# EAGLE design TSOC_WaterSensor (EAGLE 6.6.0)
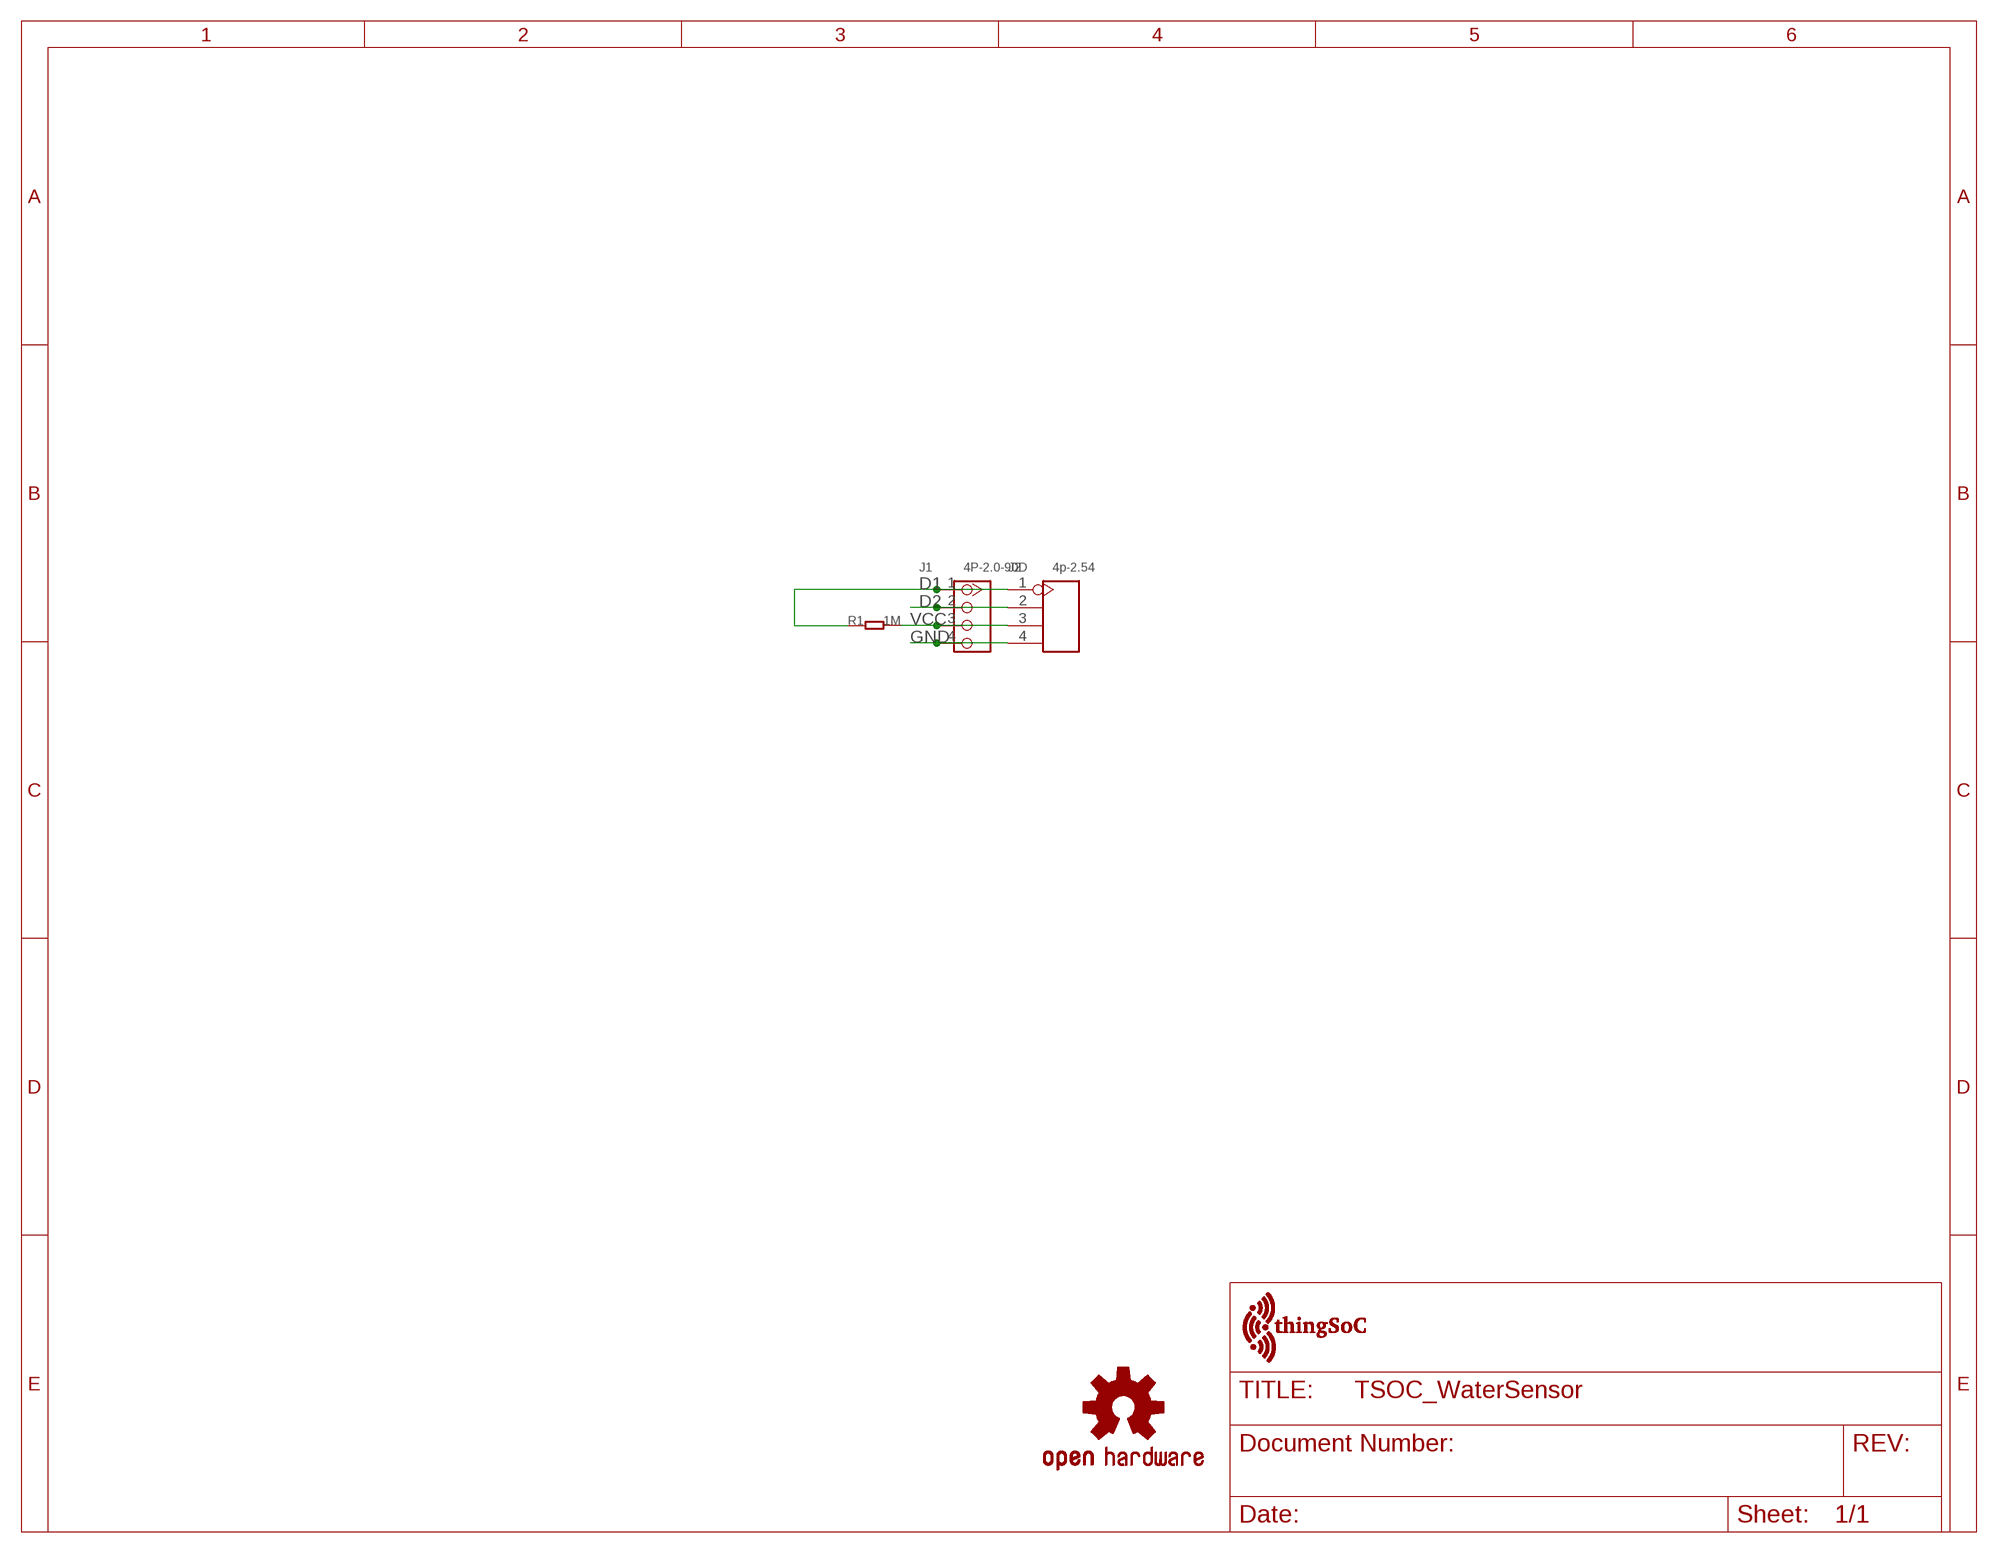
[diagram p0: schematic, sheet 1]

## Parts
J1  4P-2.0-90D  GROVE-CONNECTOR-DIP-90D(4P-2.0)  [HW4-2.0-90D]
J2  4p-2.54  DIP-BLACK-MALE-HEADER-VERT(4P-2.54)  [H4-2.54]
R1  1M  R0603  [0603]
U$1  OSHW_LOGO_SYMM  [OSHW_LOGO_MED_SYM]
U$2  TSOC-LOGO-LRG  [TSOC-LOGO-LRG]

## Nets
D1: J1.1 J2.1 R1.1
D2: J1.2 J2.2
GND: J1.4 J2.4
VCC: J1.3 J2.3 R1.2

## Library data of the parts
J1 = Seeed-Connector -2016:GROVE-CONNECTOR-DIP-90D(4P-2.0): 320110034
J2 = Seeed-Connector -2016:DIP-BLACK-MALE-HEADER-VERT(4P-2.54): 320020017; MPN: P125-1104A0BS116A1
R1 = CPT_SMD:R0603
U$1 = PatternAgents-Logos:OSHW_LOGO_SYM: OSHW_LOGO_SYM Source : http://freedomdefined.org/OSHW#Logo_repository Github : https://github.com/PatternAgents/PCB_Libraries License : http://creativecommons.org/licenses/by-sa/3.0/ (Creative Commons 3.0) THIS SOFTWARE IS PROVIDED BY THE CONTRIBUTORS "AS IS" AND WITHOUT ANY EXPRESS OR IMPLIED WARRANTIES, INCLUDING, BUT NOT LIMITED TO, THE IMPLIED WARRANTIES OF MERCHANTABILITY AND FITNESS FOR A PARTICULAR PURPOSE ARE DISCLAIMED. IN NO EVENT SHALL THE COPYRIGHT OWNER OR CONTRIBUTORS BE LIABLE FOR ANY DIRECT, INDIRECT, INCIDENTAL, SPECIAL, EXEMPLARY, OR CONSEQUENTIAL DAMAGES (INCLUDING, BUT NOT LIMITED TO, PROCUREMENT OF SUBSTITUTE GOODS OR SERVICES; LOSS OF USE, DATA, OR PROFITS; OR BUSINESS INTERRUPTION) HOWEVER CAUSED AND ON ANY THEORY OF LIABILITY, WHETHER IN CONTRACT, STRICT LIABILITY, OR TORT (INCLUDING NEGLIGENCE OR OTHERWISE) ARISING IN ANY WAY OUT OF THE USE OF THIS SOFTWARE, EVEN IF ADVISED OF THE POSSIBILITY OF SUCH DAMAGE.
U$2 = thingSoC:TSOC-LOGO: thingSoC Logo Source LBR : http://www.thingsoc.com Github : https://github.com/thingsoc License : http://creativecommons.org/licenses/by-sa/4.0/ (Creative Commons 4.0) THIS SOFTWARE IS PROVIDED BY THE CONTRIBUTORS "AS IS" AND WITHOUT ANY EXPRESS OR IMPLIED WARRANTIES, INCLUDING, BUT NOT LIMITED TO, THE IMPLIED WARRANTIES OF MERCHANTABILITY AND FITNESS FOR A PARTICULAR PURPOSE ARE DISCLAIMED. IN NO EVENT SHALL THE COPYRIGHT OWNER OR CONTRIBUTORS BE LIABLE FOR ANY DIRECT, INDIRECT, INCIDENTAL, SPECIAL, EXEMPLARY, OR CONSEQUENTIAL DAMAGES (INCLUDING, BUT NOT LIMITED TO, PROCUREMENT OF SUBSTITUTE GOODS OR SERVICES; LOSS OF USE, DATA, OR PROFITS; OR BUSINESS INTERRUPTION) HOWEVER CAUSED AND ON ANY THEORY OF LIABILITY, WHETHER IN CONTRACT, STRICT LIABILITY, OR TORT (INCLUDING NEGLIGENCE OR OTHERWISE) ARISING IN ANY WAY OUT OF THE USE OF THIS SOFTWARE, EVEN IF ADVISED OF THE POSSIBILITY OF SUCH DAMAGE.

## Board
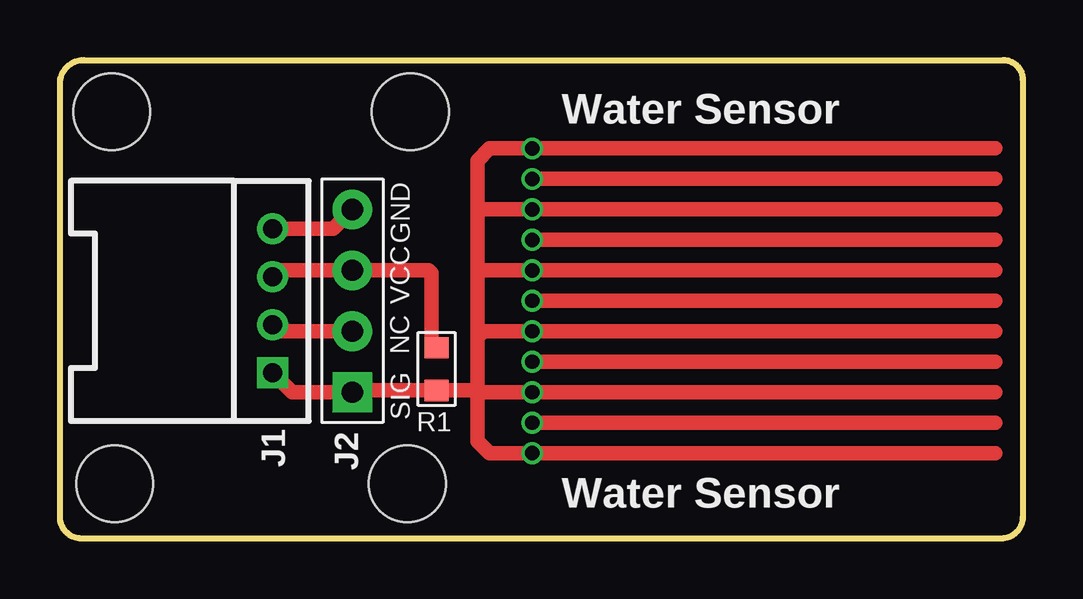
[diagram p1: board, top side]
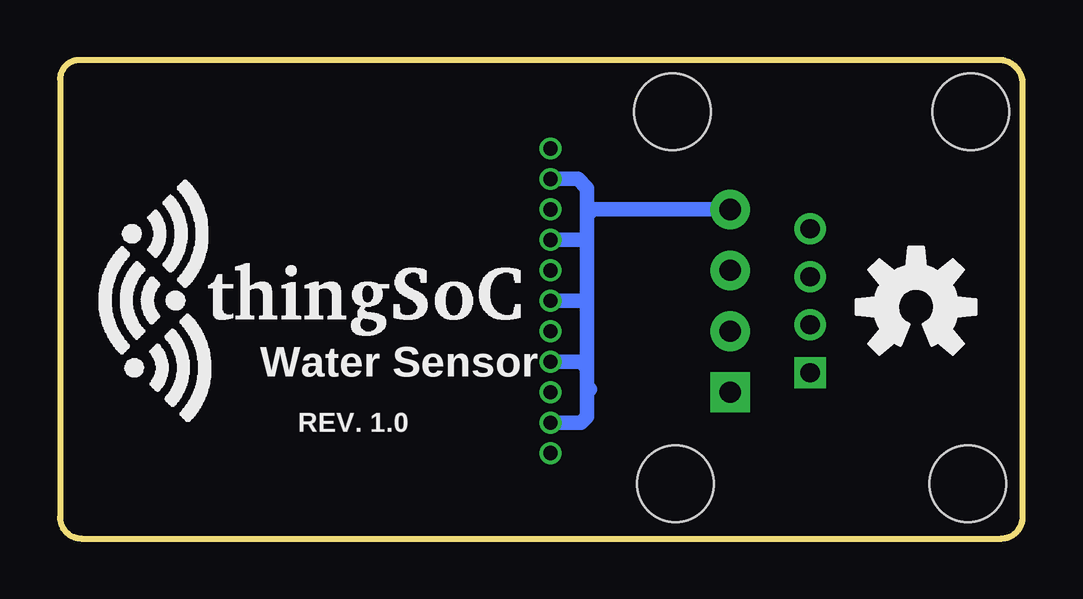
[diagram p2: board, bottom side, seen from below]

Size 40.13 x 19.94 mm. Coordinates in mm from the lower left corner, seen from the top.
Outline: 39.23,0 0.9,0 arc-90 0,0.9 0,18.95 arc-90 0.99,19.94 39.32,19.94 arc-90 40.13,19.13 40.13,0.9 arc-90 39.23,0
Copper layers (1*16): Top 0.035mm / dielectric 1.5mm / Bottom 0.035mm
Design rules "SeeedStudio_rule_no_angle_090911": minimum track width 6mil, minimum drill 12mil, track to track 6mil, track to pad 6mil, pad to pad 6mil, via to via 6mil, smd to smd 0mil, copper to edge 10mil, drill to drill 10mil, minimum pad ring 10mil, minimum via ring 6mil, stop-mask expansion 2mil, vias tented up to drill 100mil, thermal gap 10mil
Holes 3.2 mm at 14.61,17.78 14.48,2.29 2.16,17.78 2.29,2.29 2.29,2.29

### Footprints (pad centres in the part's own frame; a part is rotated, then mirrored left to right if it is on the bottom)
HW4-2.0-90D = drill 0.8 pad 1.27 square: 1 -3,0 | drill 0.8 pad 1.27: 2 -1,0; 3 1,0; 4 3,0
H4-2.54 = drill 0.889 pad 1.651 square: 1 0,3.81 | drill 0.889 pad 1.651: 2 0,1.27; 3 0,-1.27; 4 0,-3.81
0603 = smd 0.889 x 1.016: 1 -0.889,0; 2 0.889,0

### Placement (x,y rotation side)
J1  8.86,9.91 90 top
J2  12.19,9.91 180 top
R1  15.7,7.06 90 top
U$1  4.45,9.65 0 bottom
U$2  35.31,9.91 0 bottom

### Tracks (layer width: path | path; a pad name or v marks a point on that pad's centre or on a via)
D1  (via drill 0.6)
  Top 0.61: 38.99,11.18 v19.68,11.18 17.53,11.18 17.4,11.05 | 38.99,13.72 v19.68,13.72 17.4,13.72 | 38.99,8.64 v19.68,8.64 17.65,8.64 17.4,8.38 | 38.99,3.56 v19.68,3.56 17.91,3.56 17.4,4.06 17.4,6.1 | 38.99,16.26 v19.68,16.26 17.91,16.26 17.4,15.75 17.4,13.72 | 38.99,6.1 v19.68,6.1 17.53,6.1 17.4,6.22 | 17.4,11.05 17.4,8.38 | 17.4,8.38 17.4,6.22 | 17.4,6.22 17.4,6.1 | 17.4,11.05 17.4,13.72 | 17.4,6.1 17.32,6.17 R1.1 12.27,6.17 J2.1 9.68,6.1 J1.1
D2
  Top 0.61: J2.2 9.13,8.64 J1.2
GND  (via drill 0.6)
  Top 0.61: v19.68,4.83 38.99,4.83 | 38.99,12.45 v19.68,12.45 | v19.68,9.91 38.99,9.91 | v19.68,7.37 38.99,7.37 | v19.68,14.99 38.99,14.99 | J1.4 11.38,12.91 J2.4
  Bottom 0.61: v19.68,4.83 18.41,4.83 18.16,5.08 18.16,6.35 | 18.16,6.35 18.16,7.11 | 18.16,7.11 18.16,9.91 | 18.16,9.91 18.16,12.32 | 18.16,12.32 18.16,13.46 | 18.16,13.46 18.16,14.61 18.54,14.99 v19.68,14.99 | v19.68,7.37 18.41,7.37 18.16,7.11 | v19.68,9.91 18.16,9.91 | v19.68,12.45 18.29,12.45 18.16,12.32 | 18.03,6.22 18.16,6.35 | J2.4 17.91,13.72 18.16,13.46
VCC
  Top 0.61: R1.2 15.49,8.03 15.49,11.05 15.37,11.18 J2.3 9.13,11.18 J1.3

### Text on the board
tPlace: Water Sensor | GND | VCC | NC | SIG | J1 | Water Sensor
bPlace: Water Sensor | REV. 1.0